# Altium schematic sheet POWER.SchDoc
size A4
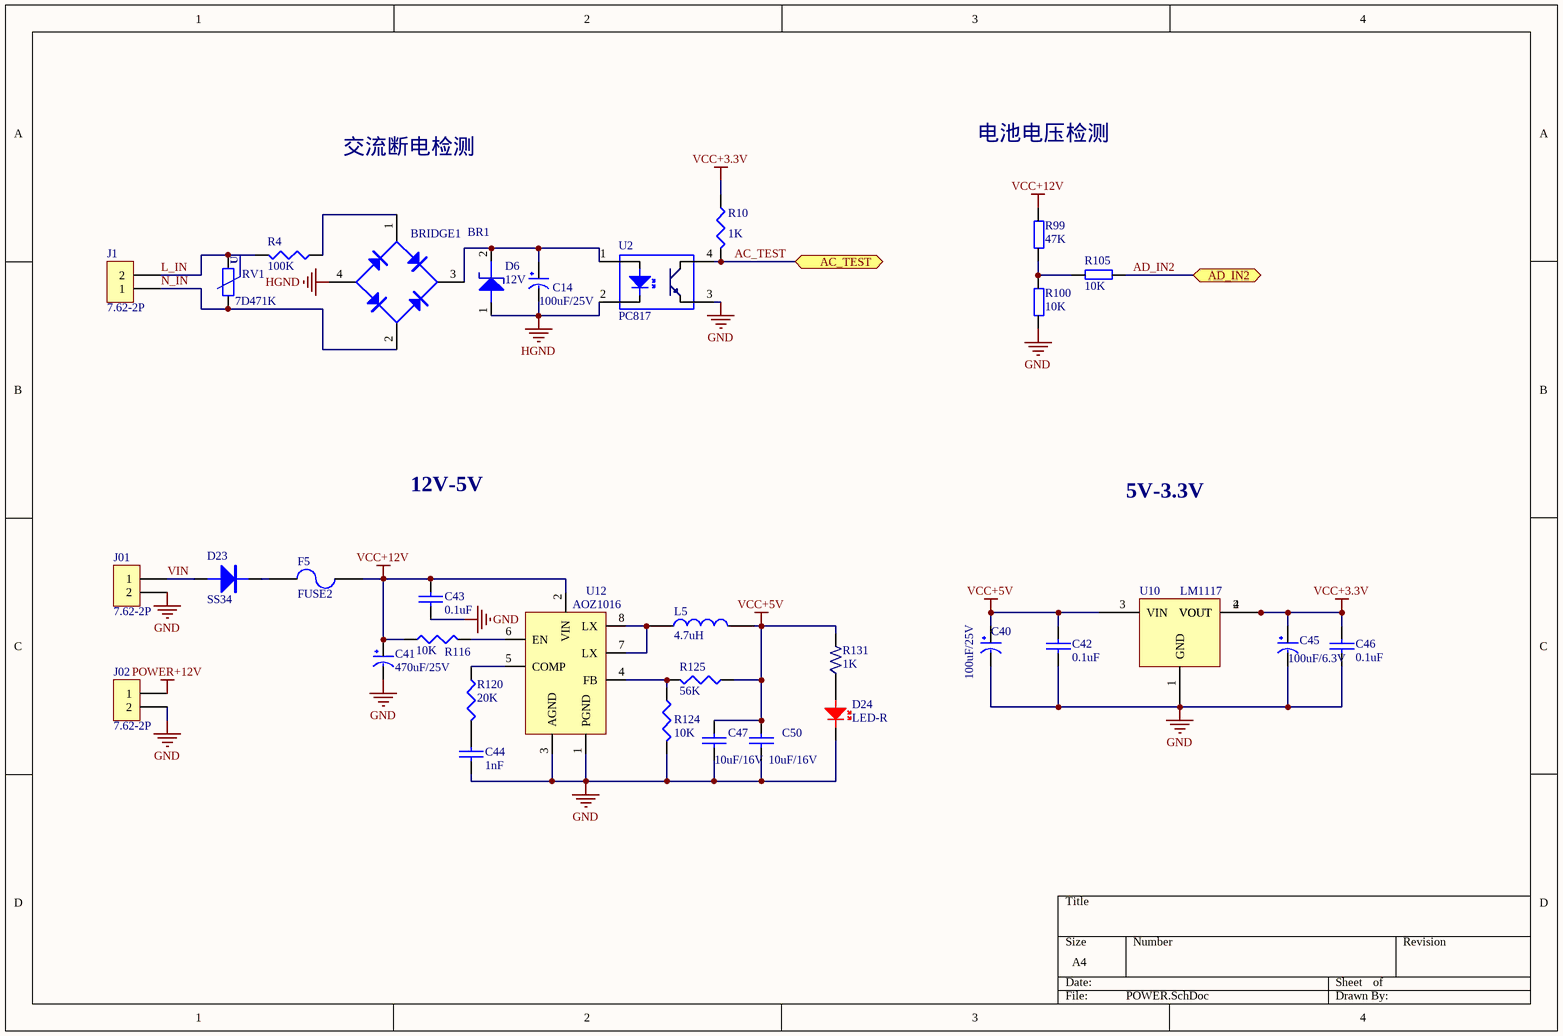
[diagram p0: POWER.SchDoc]

## Parts
BR1  BRIDGE1  [soic-4]
C14  100uF/25V  [RB2.54]
C40  100uF/25V  [RB2.54]
C41  470uF/25V  [RB3.5]
C42  0.1uF  [0603]
C43  0.1uF  [0603]
C44  1nF  [0603]
C45  100uF/6.3V  [RB2.54]
C46  0.1uF  [0603]
C47  10uF/16V  [0805]
C50  10uF/16V  [0805]
D6  12V  [SOD-123A]
D23  SS34  [SMB]
D24  LED-R  [LED-0603]
F5  FUSE2  [FUSE RL60-110]
J1  7.62-2P  [7.62-2]
J01  7.62-2P  [5.08-2P]
J02  7.62-2P  [5.08-2P]
L5  4.7uH  [INDUCTOR 7*7]
R4  100K  [AXIAL0.6]
R10  1K  [0603]
R99  47K  [0603]
R100  10K  [0603]
R105  10K  [0603]
R116  10K  [0603]
R120  20K  [0603]
R124  10K  [0603]
R125  56K  [0603]
R131  1K  [0603]
RV1  7D471K  [7D471]
U2  PC817  [DIP4]
U10  LM1117  [SOT-223]
U12  AOZ1016  [SO-8]

## Ports
AC_TEST, AD_IN2

## Nets
GND: C40.2(GND) C41.2(GND) C42.2 C43.2 C44.2 C45.2(GND) C46.2 C47.2 C50.2 D24.2 J01.2 J02.2 R100.1 R124.2 U2.3 U10.1(GND) U12.1(PGND) U12.3(AGND)
HGND: BR1.4(V-) C14.2(GND) D6.1(A) U2.2
POWER+12V: J02.1
VCC+3.3V: C45.1(VCC) C46.1 R10.1 U10.2(VOUT) U10.4(VOUT)
VCC+5V: C40.1(VCC) C42.1 C47.1 C50.1 L5.2 R125.1 R131.2 U10.3(VIN)
VCC+12V: C41.1(VCC) C43.1 F5.2 R99.2 R116.1 U12.2(VIN)
AC_TEST: R10.2 U2.4 ; port AC_TEST
AD_IN2: R105.1 ; port AD_IN2
L_IN: J1.2 R4.2 RV1.2
N_IN: BR1.2(AC) J1.1 RV1.1
VIN: D23.1(A) J01.1
NetBR1_1: BR1.1(V+) R4.1
NetBR1_3: BR1.3(AC) C14.1(VCC) D6.2(K) U2.1
NetC44_1: C44.1 R120.2
NetD23_2: D23.2(K) F5.1
NetD24_1: D24.1 R131.1
NetL5_1: L5.1 U12.7(LX) U12.8(LX)
NetR99_1: R99.1 R100.2 R105.2
NetR116_2: R116.2 U12.6(EN)
NetR120_1: R120.1 U12.5(COMP)
NetR124_1: R124.1 R125.2 U12.4(FB)

## Notes on the sheet
- 交流断电检测
- 电池电压检测
- 12V-5V
- 5V-3.3V
- (in symbol RV) U

## Library data of the parts
C14 C40-C44 C46 C47 C50 = CAP
C45 = CAP: 钽电容
D6 = Zener Diode
D23 = DIODE
D24 = LED-RED: 绿色LED
F5 = FUSE2: RL60-110
J1 J01 J02 = SIP2A-2.50（带槽）
L5 = INDUCTOR
R4 R10 R116 R120 R124 R125 = RES1
R99 R100 R105 = Res
R131 = RES-1%: 高精度电阻
RV1 = RV
U2 = TLP521: 光耦